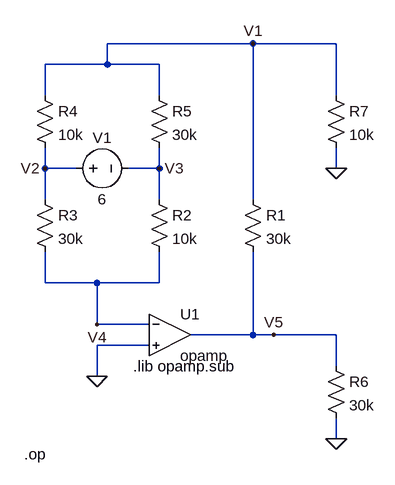
[diagram p0: schematic ComplexOpampCircuit.asc]
ComplexOpampCircuit.asc, the LTspice schematic file:
Version 4
SHEET 1 880 680
WIRE 352 -272 128 -272
WIRE 480 -272 352 -272
WIRE 128 -240 128 -272
WIRE 128 -240 32 -240
WIRE 208 -240 128 -240
WIRE 32 -192 32 -240
WIRE 208 -192 208 -240
WIRE 480 -192 480 -272
WIRE 32 -80 32 -112
WIRE 80 -80 32 -80
WIRE 208 -80 208 -112
WIRE 208 -80 160 -80
WIRE 480 -80 480 -112
WIRE 32 -32 32 -80
WIRE 208 -32 208 -80
WIRE 352 -32 352 -272
WIRE 32 96 32 48
WIRE 112 96 32 96
WIRE 208 96 208 48
WIRE 208 96 112 96
WIRE 112 160 112 96
WIRE 192 160 112 160
WIRE 352 176 352 48
WIRE 352 176 256 176
WIRE 384 176 352 176
WIRE 480 176 384 176
WIRE 192 192 112 192
WIRE 480 224 480 176
WIRE 112 240 112 192
WIRE 480 336 480 304
FLAG 112 240 0
FLAG 480 336 0
FLAG 480 -80 0
FLAG 112 160 V4
FLAG 384 176 V5
FLAG 208 -80 V3
FLAG 32 -80 V2
FLAG 352 -272 V1
SYMBOL OpAmps\\opamp 224 112 R0
SYMATTR InstName U1
SYMBOL res 336 -48 R0
SYMATTR InstName R1
SYMATTR Value 30k
SYMBOL res 192 -48 R0
SYMATTR InstName R2
SYMATTR Value 10k
SYMBOL res 16 -48 R0
SYMATTR InstName R3
SYMATTR Value 30k
SYMBOL res 16 -208 R0
SYMATTR InstName R4
SYMATTR Value 10k
SYMBOL res 192 -208 R0
SYMATTR InstName R5
SYMATTR Value 30k
SYMBOL res 464 208 R0
SYMATTR InstName R6
SYMATTR Value 30k
SYMBOL res 464 -208 R0
SYMATTR InstName R7
SYMATTR Value 10k
SYMBOL voltage 64 -80 R270
WINDOW 0 32 56 VTop 2
WINDOW 3 -32 56 VBottom 2
WINDOW 123 0 0 Left 0
WINDOW 39 0 0 Left 0
SYMATTR InstName V1
SYMATTR Value 6
TEXT 0 360 Left 2 !.op
TEXT 168 224 Left 2 !.lib opamp.sub

The netlist it stands for:
* ComplexOpampCircuit.asc
XU1 V4 0 V5 opamp Aol=100K GBW=10Meg  ; pins invin noninvin out
R1 V1 V5 30k
R2 V3 V4 10k
R3 V2 V4 30k
R4 V1 V2 10k
R5 V1 V3 30k
R6 V5 0 30k
R7 V1 0 10k
V1 V2 V3 6
.op
.lib opamp.sub
.backanno
.end